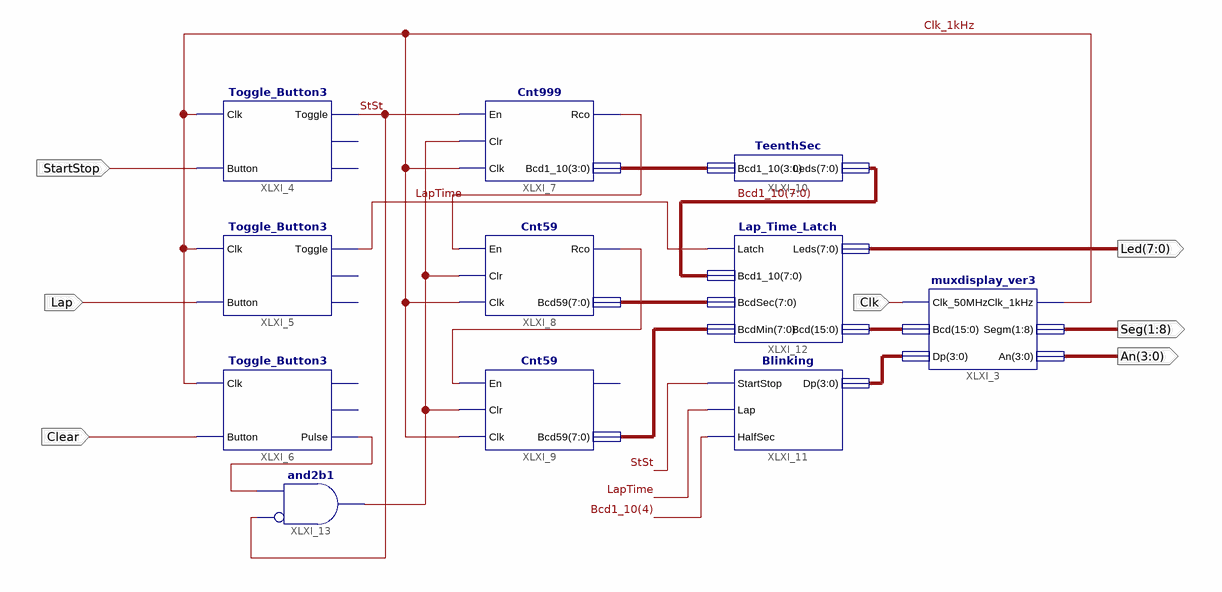
[diagram p0: schematic sheet 1]
// Xilinx ISE schematic Stopwatch.sch (spartan3e) as structural Verilog: 11 symbols, 7 ports
module Stopwatch (
  input  StartStop,
  input  Lap,
  input  Clear,
  input  Clk,
  output [7:0] Led,
  output [1:8] Seg,
  output [3:0] An
);

  wire Clk_1kHz, LapTime, StSt, XLXN_6, XLXN_9, XLXN_15, XLXN_16;
  wire [3:0] XLXN_17, XLXN_38;
  wire [7:0] Bcd1_10, XLXN_21, XLXN_24;
  wire [15:0] XLXN_37;

  muxdisplay_ver3 XLXI_3 (.Clk_50MHz(Clk), .Bcd(XLXN_37), .Dp(XLXN_38), .Clk_1kHz(Clk_1kHz), .Segm(Seg), .An(An));
  Toggle_Button3 XLXI_4 (.Clk(Clk_1kHz), .Button(StartStop), .Toggle(StSt));  // open: Deboun, Pulse
  Toggle_Button3 XLXI_5 (.Clk(Clk_1kHz), .Button(Lap), .Toggle(LapTime));  // open: Deboun, Pulse
  Toggle_Button3 XLXI_6 (.Clk(Clk_1kHz), .Button(Clear), .Pulse(XLXN_6));  // open: Toggle, Deboun
  Cnt999 XLXI_7 (.En(StSt), .Clr(XLXN_9), .Clk(Clk_1kHz), .Rco(XLXN_16), .Bcd1_10(XLXN_17));
  Cnt59 XLXI_8 (.En(XLXN_16), .Clr(XLXN_9), .Clk(Clk_1kHz), .Rco(XLXN_15), .Bcd59(XLXN_21));
  Cnt59 XLXI_9 (.En(XLXN_15), .Clr(XLXN_9), .Clk(Clk_1kHz), .Bcd59(XLXN_24));  // open: Rco
  TeenthSec XLXI_10 (.Bcd1_10(XLXN_17), .Leds(Bcd1_10));
  Blinking XLXI_11 (.StartStop(StSt), .Lap(LapTime), .HalfSec(Bcd1_10[4]), .Dp(XLXN_38));
  Lap_Time_Latch XLXI_12 (
    .Latch(LapTime), .Bcd1_10(Bcd1_10), .BcdSec(XLXN_21), .BcdMin(XLXN_24), .Leds(Led), .Bcd(XLXN_37));
  and XLXI_13 (XLXN_9, ~StSt, XLXN_6);  // and2b1
endmodule
